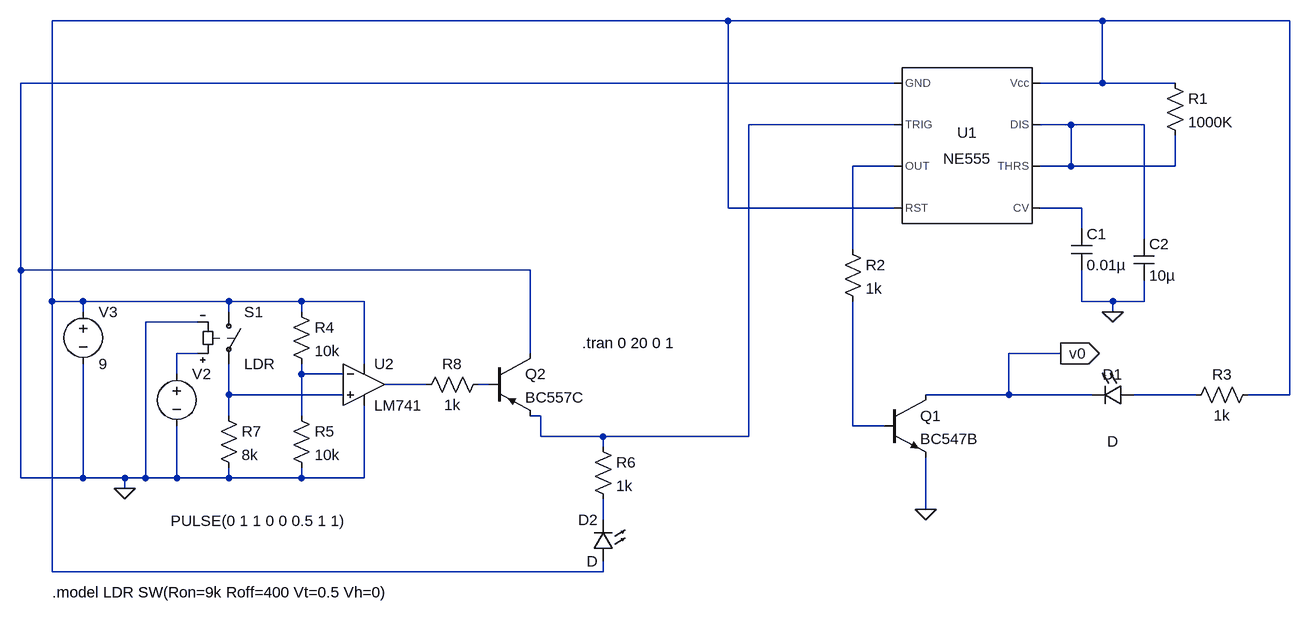
[diagram p0: schematic AnalogProject.asc]
AnalogProject.asc, the LTspice schematic file:
Version 4
SHEET 1 916 912
WIRE -224 16 -1264 16
WIRE 352 16 -224 16
WIRE 640 16 352 16
WIRE 32 112 -1312 112
WIRE 352 112 352 16
WIRE 352 112 256 112
WIRE 464 112 352 112
WIRE 32 176 -192 176
WIRE 304 176 256 176
WIRE 416 176 304 176
WIRE 32 240 -32 240
WIRE 304 240 304 176
WIRE 304 240 256 240
WIRE 464 240 464 192
WIRE 464 240 304 240
WIRE -224 304 -224 16
WIRE 32 304 -224 304
WIRE 320 304 256 304
WIRE 320 336 320 304
WIRE 416 352 416 176
WIRE -32 368 -32 240
WIRE -1312 400 -1312 112
WIRE -528 400 -1312 400
WIRE -1264 448 -1264 16
WIRE -1216 448 -1264 448
WIRE -992 448 -1216 448
WIRE -880 448 -992 448
WIRE -784 448 -880 448
WIRE 320 448 320 400
WIRE 368 448 320 448
WIRE 416 448 416 416
WIRE 416 448 368 448
WIRE -1216 464 -1216 448
WIRE -992 464 -992 448
WIRE -880 464 -880 448
WIRE 368 464 368 448
WIRE -1040 480 -1120 480
WIRE -1040 528 -1072 528
WIRE -528 528 -528 400
WIRE 288 528 208 528
WIRE -784 544 -784 448
WIRE -1072 560 -1072 528
WIRE -880 560 -880 544
WIRE -816 560 -880 560
WIRE -688 576 -752 576
WIRE -592 576 -608 576
WIRE -992 592 -992 544
WIRE -816 592 -992 592
WIRE 208 592 208 528
WIRE 208 592 80 592
WIRE 336 592 208 592
WIRE 496 592 400 592
WIRE 640 592 640 16
WIRE 640 592 576 592
WIRE -992 624 -992 592
WIRE -880 624 -880 560
WIRE -512 624 -528 624
WIRE -32 640 -32 448
WIRE 16 640 -32 640
WIRE -512 656 -512 624
WIRE -416 656 -512 656
WIRE -192 656 -192 176
WIRE -192 656 -416 656
WIRE -416 672 -416 656
WIRE -1312 720 -1312 400
WIRE -1216 720 -1216 544
WIRE -1216 720 -1312 720
WIRE -1152 720 -1216 720
WIRE -1120 720 -1120 480
WIRE -1120 720 -1152 720
WIRE -1072 720 -1072 640
WIRE -1072 720 -1120 720
WIRE -992 720 -992 704
WIRE -992 720 -1072 720
WIRE -880 720 -880 704
WIRE -880 720 -992 720
WIRE -784 720 -784 608
WIRE -784 720 -880 720
WIRE -1152 736 -1152 720
WIRE 80 768 80 688
WIRE -416 784 -416 752
WIRE -1264 864 -1264 448
WIRE -416 864 -416 848
WIRE -416 864 -1264 864
FLAG 368 464 0
FLAG 80 768 0
FLAG 288 528 v0
IOPIN 288 528 Out
FLAG -1152 736 0
SYMBOL Misc\\NE555 144 208 R0
SYMATTR InstName U1
SYMBOL cap 304 336 R0
SYMATTR InstName C1
SYMATTR Value 0.01µ
SYMBOL res 448 96 R0
SYMATTR InstName R1
SYMATTR Value 1000K
SYMBOL cap 400 352 R0
SYMATTR InstName C2
SYMATTR Value 10µ
SYMBOL res -48 352 R0
SYMATTR InstName R2
SYMATTR Value 1k
SYMBOL npn 16 592 R0
SYMATTR InstName Q1
SYMATTR Value BC547B
SYMBOL LM741 -784 512 R0
SYMATTR InstName U2
SYMBOL voltage -1216 448 R0
WINDOW 123 0 0 Left 0
WINDOW 39 0 0 Left 0
SYMATTR InstName V3
SYMATTR Value 9
SYMBOL res -896 448 R0
SYMATTR InstName R4
SYMATTR Value 10k
SYMBOL res -896 608 R0
SYMATTR InstName R5
SYMATTR Value 10k
SYMBOL res -1008 608 R0
SYMATTR InstName R7
SYMATTR Value 8k
SYMBOL pnp -592 528 R0
SYMATTR InstName Q2
SYMATTR Value BC557C
SYMBOL res -592 560 R90
WINDOW 0 0 56 VBottom 2
WINDOW 3 32 56 VTop 2
SYMATTR InstName R8
SYMATTR Value 1k
SYMBOL sw -992 448 R0
SYMATTR InstName S1
SYMATTR Value LDR
SYMBOL voltage -1072 544 R0
WINDOW 3 -9 242 Left 2
WINDOW 123 0 0 Left 0
WINDOW 39 0 0 Left 0
SYMATTR Value PULSE(0 1 1 0 0 0.5 1 1)
SYMATTR InstName V2
SYMBOL res -432 656 R0
SYMATTR InstName R6
SYMATTR Value 1k
SYMBOL LED -400 848 R180
WINDOW 0 24 64 Left 2
WINDOW 3 24 0 Left 2
SYMATTR InstName D2
SYMBOL LED 400 576 R90
WINDOW 0 0 32 VBottom 2
WINDOW 3 72 32 VTop 2
SYMATTR InstName D1
SYMBOL res 592 576 R90
WINDOW 0 0 56 VBottom 2
WINDOW 3 32 56 VTop 2
SYMATTR InstName R3
SYMATTR Value 1k
TEXT -448 512 Left 2 !.tran 0 20 0 1
TEXT -1264 896 Left 2 !.model LDR SW(Ron=9k Roff=400 Vt=0.5 Vh=0)

The netlist it stands for:
* AnalogProject.asc
XU1 0 N002 N004 N001 N005 N003 N003 N001 NE555  ; pins GND TRIG OUT RST CV THRS DIS Vcc
C1 N005 0 0.01µ
R1 N001 N003 1000K
C2 N003 0 10µ
R2 N004 N012 1k
Q1 v0 N012 0 0 BC547B
XU2 N010 N007 N001 0 N008 LM741  ; pins In+ In- V+ V- OUT
V3 N001 0 9
R4 N001 N007 10k
R5 N007 0 10k
R7 N010 0 8k
Q2 0 N009 N002 0 BC557C
R8 N009 N008 1k
S1 N001 N010 N006 0 LDR
V2 N006 0 PULSE(0 1 1 0 0 0.5 1 1)
R6 N002 N013 1k
D2 N001 N013 D
D1 N011 v0 D
R3 N001 N011 1k
.model D D
.lib standard.dio
.model NPN NPN
.model PNP PNP
.lib standard.bjt
.tran 0 20 0 1
.model LDR SW(Ron=9k Roff=400 Vt=0.5 Vh=0)
.lib NE555.sub
.lib LM741.lib
.backanno
.end